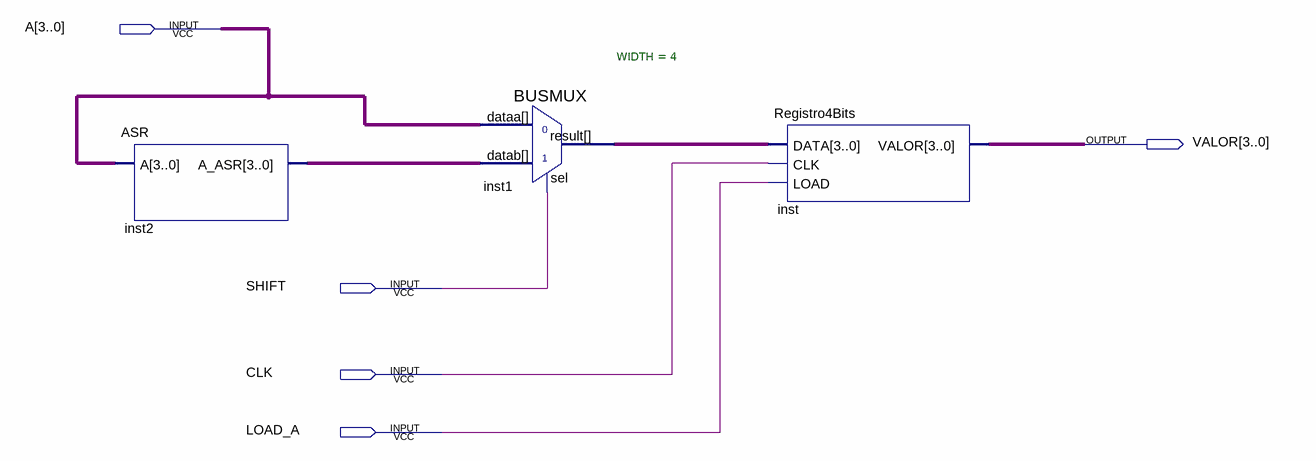
[diagram p0: schematic sheet]
// Quartus schematic RegistroA.bdf as structural Verilog: 3 symbols, 5 pins
module RegistroA (
  input  [3:0] A,
  input  SHIFT,
  input  CLK,
  input  LOAD_A,
  output [3:0] VALOR
);

  wire [3:0] inst1_result, inst2_a_asr;

  ASR inst2 (.A(A), .A_ASR(inst2_a_asr));
  BUSMUX #(.WIDTH(4)) inst1 (.datab(inst2_a_asr), .sel(SHIFT), .dataa(A), .result(inst1_result));
  Registro4Bits inst (.DATA(inst1_result), .CLK(CLK), .LOAD(LOAD_A), .VALOR(VALOR));
endmodule
